# EAGLE design power (EAGLE 9.6.2)
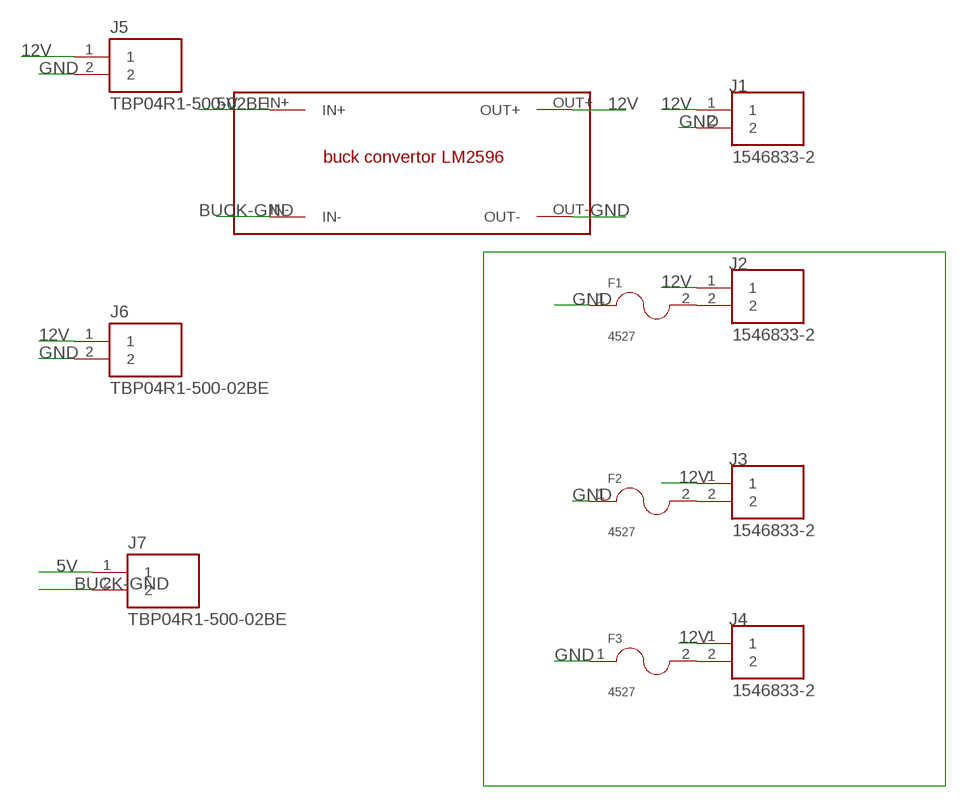
[diagram p0: schematic, sheet 1]

## Parts
F1  4527  [FUSE_4527]
F2  4527  [FUSE_4527]
F3  4527  [FUSE_4527]
J1  1546833-2  [TE_1546833-2]
J2  1546833-2  [TE_1546833-2]
J3  1546833-2  [TE_1546833-2]
J4  1546833-2  [TE_1546833-2]
J5  TBP04R1-500-02BE  [CUI_TBP04R1-500-02BE]
J6  TBP04R1-500-02BE  [CUI_TBP04R1-500-02BE]
J7  TBP04R1-500-02BE  [CUI_TBP04R1-500-02BE]
U$1  LM2596  [LM2596]

## Nets
5V: J7.1 U$1.IN+
12V: J1.1 J2.1 J3.1 J4.1 J5.1 J6.1 U$1.OUT+
BUCK-GND: J7.2 U$1.IN-
GND: F1.1 F2.1 F3.1 J1.2 J5.2 J6.2 U$1.OUT-
N$2: F1.2 J2.2
N$3: F2.2 J3.2
N$4: F3.2 J4.2

## Library data of the parts
F1-F3 = fuse holder:4527: Check availability <https://pricing.snapeda.com/parts/4527/Keystone/view-part?ref=eda>; AVAILABILITY: In Stock; CHECK_PRICES: https://www.snapeda.com/parts/4527/Keystone/view-part/?ref=eda; DESCRIPTION: 5mm Low Profile Holder; MF: Keystone; MP: 4527; PACKAGE: None; PRICE: None; SNAPEDA_LINK: https://www.snapeda.com/parts/4527/Keystone/view-part/?ref=snap
J1-J4 = barrier terminal block 9.5mm:1546833-2: Check availability <https://pricing.snapeda.com/parts/1546833-2/TE%20Connectivity/view-part?ref=eda>; AVAILABILITY: In Stock; CHECK_PRICES: https://www.snapeda.com/parts/1546833-2/TE+Connectivity+AMP+Connectors/view-part/?ref=eda; COMMENT: 1546833-2; DESCRIPTION: 2 Circuit 0.375 (9.53mm) Barrier Block Connector, Screws with Captive Plate; MF: TE Connectivity; MP: 1546833-2; PACKAGE: None; PRICE: None; SNAPEDA_LINK: https://www.snapeda.com/parts/1546833-2/TE+Connectivity+AMP+Connectors/view-part/?ref=snap
J5-J7 = pluggable terminal block:TBP04R1-500-02BE: Terminal Block Check availability <https://pricing.snapeda.com/parts/TBP04R1-500-02BE/Same%20Sky/view-part?ref=eda>; AVAILABILITY: In Stock; CHECK_PRICES: https://www.snapeda.com/parts/TBP04R1-500-02BE/Same+Sky/view-part/?ref=eda; DESCRIPTION: 2~24 Poles, Pluggable, Receptacle, Horizontal, 5.0 Pitch, Terminal Block Connector; MF: Same Sky; MP: TBP04R1-500-02BE; PACKAGE: None; PRICE: None; SNAPEDA_LINK: https://www.snapeda.com/parts/TBP04R1-500-02BE/Same+Sky/view-part/?ref=snap
U$1 = buck:LM2596

## Board
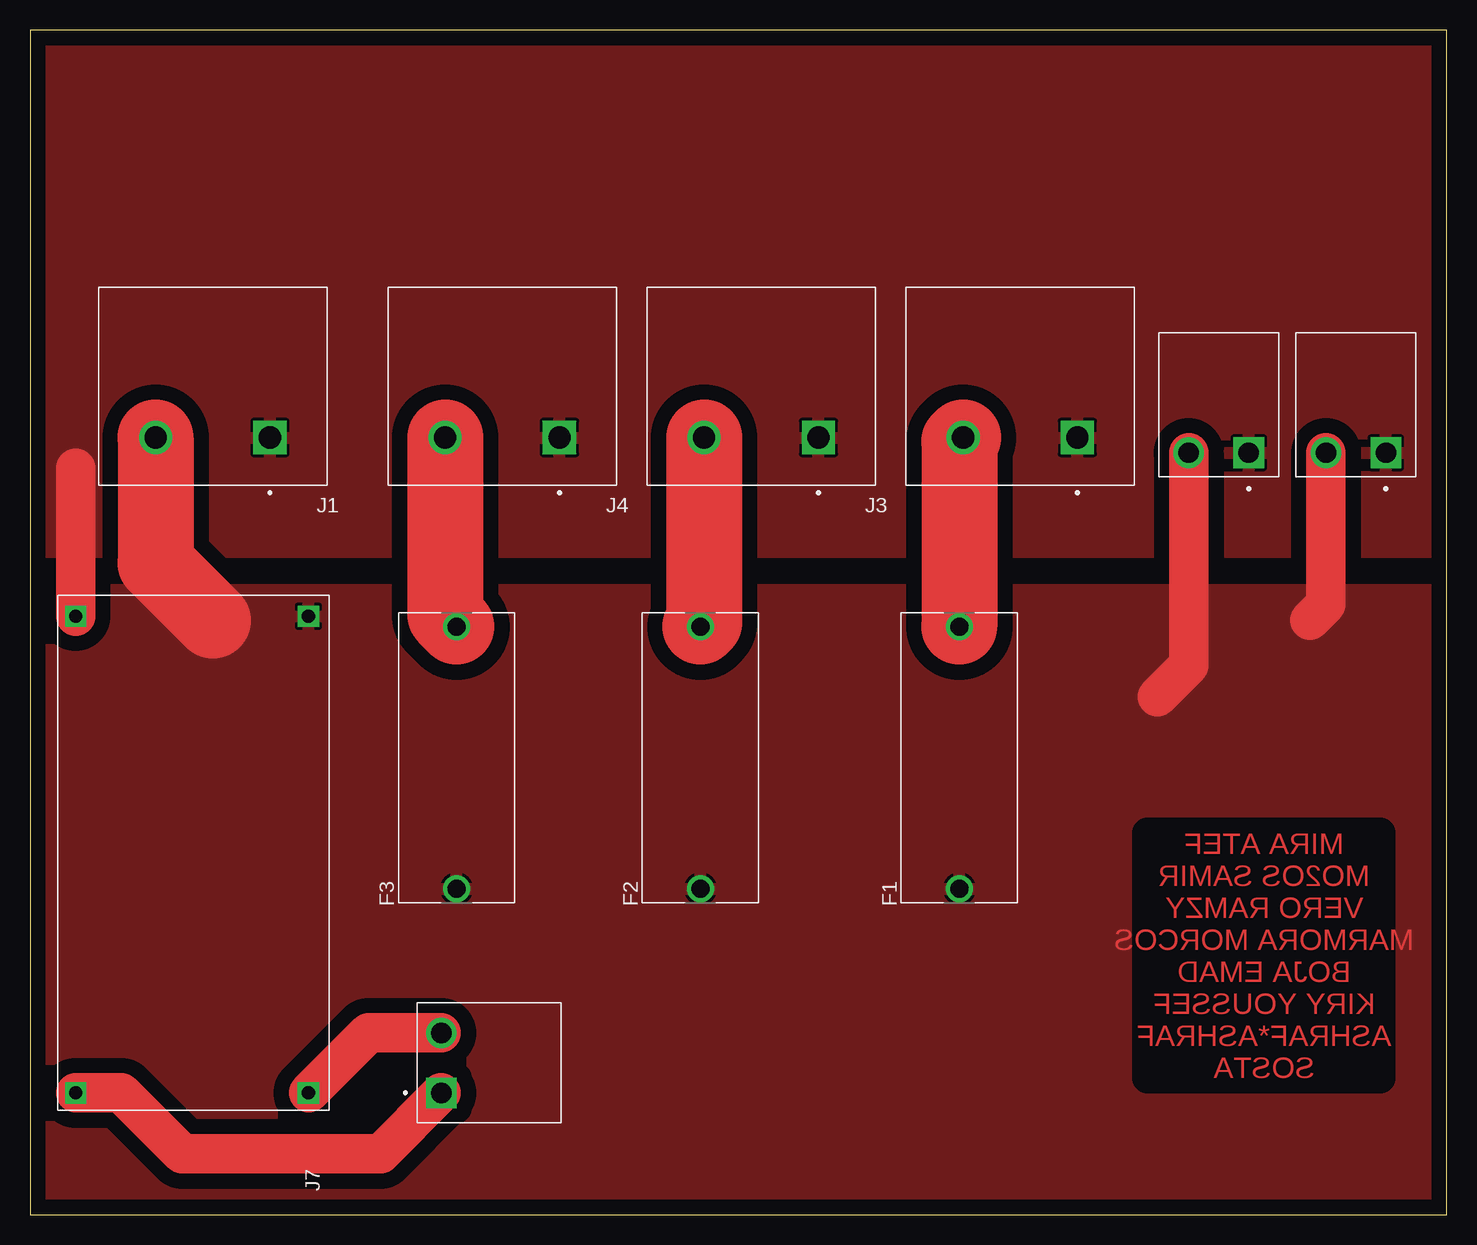
[diagram p1: board, top side]

Size 118.09 x 98.73 mm. Coordinates in mm from the lower left corner, seen from the top.
Outline: 0,0 118.09,0 118.09,98.73 0,98.73 0,0
Copper layers (1*16): Top 0.035mm / dielectric 1.5mm / Bottom 0.035mm
Design rules "default": minimum track width 6mil, minimum drill 0.35mm, track to track 6mil, track to pad 6mil, pad to pad 6mil, via to via 6mil, smd to smd 6mil, copper to edge 40mil, drill to drill 6mil, minimum pad ring 10mil, minimum via ring 8mil, stop-mask expansion 4mil, vias tented up to drill 0mil, thermal gap 10mil

### Footprints (pad centres in the part's own frame; a part is rotated, then mirrored left to right if it is on the bottom)
FUSE_4527 = drill 1.5: 1 -10.92,0; 2 10.92,0
TE_1546833-2 = drill 1.85 square: 1 -4.765,0 | drill 1.85: 2 4.765,0
CUI_TBP04R1-500-02BE = drill 1.7 square: 1 0,0 | drill 1.7: 2 5,0
LM2596 = drill 1.1 pad 1.778 square: IN+ 0,0; IN- 0,-19.4; OUT+ 39.72,0; OUT- 39.72,-19.4

### Placement (x,y rotation side)
F1  77.47,38.1 90 top
F2  55.88,38.1 90 top
F3  35.56,38.1 90 top
J1  15.24,64.77 180 top
J2  82.55,64.77 180 top
J3  60.96,64.77 180 top
J4  39.37,64.77 180 top
J5  101.6,63.5 180 top
J6  113.03,63.5 180 top
J7  34.29,10.16 90 top
U$1  3.81,10.16 90 top

### Tracks (layer width: path | path; a pad name or v marks a point on that pad's centre or on a via)
5V
  Top 3.302: U$1.IN+ 7.62,10.16 12.7,5.08 29.21,5.08 J7.1
12V
  Top 3.302: U$1.OUT+ 3.81,62.23
  pour Top (isolate 1.27): 0,55.24 118.11,55.24 118.11,99.06 0,99.06
BUCK-GND
  Top 3.302: U$1.IN- 28.21,15.16 J7.2
GND
  Top 3.302: J5.2 96.6,45.8 93.98,43.18 | J6.2 108.03,50.88 106.68,49.53
  Top 6.35: J1.2 10.47,54.3 15.24,49.53
  pour Top (isolate 1.27): 0,0 0,52.07 118.11,52.07 118.11,0
N$2
  Top 6.35: J2.2 77.47,64.45 F1.2
N$3
  Top 6.35: J3.2 56.2,49.34 F2.2
N$4
  Top 6.35: J4.2 34.6,49.98 F3.2

### Text on the board
Top: MIRA ATEF / MO2OS SAMIR / VERO RAMZY / MARMORA MORCOS / BOJA EMAD / KIRY YOUSSEF / ASHRAF*ASHRAF / SOSTA